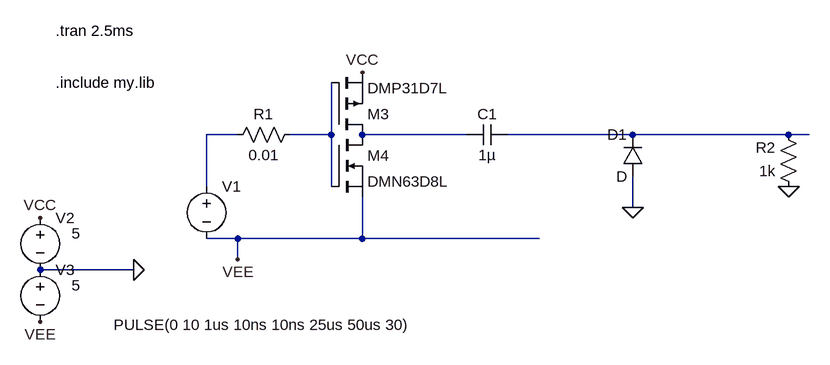
[diagram p0: schematic Draft102.asc]
Draft102.asc, the LTspice schematic file:
Version 4
SHEET 1 5720 1740
WIRE -48 -64 -96 -64
WIRE 96 -64 96 -144
WIRE 96 -64 32 -64
WIRE 304 -64 144 -64
WIRE 560 -64 368 -64
WIRE 800 -64 560 -64
WIRE 832 -64 800 -64
WIRE -96 16 -96 -64
WIRE 96 16 96 -64
WIRE 560 48 560 0
WIRE -48 96 -96 96
WIRE 144 96 144 32
WIRE 144 96 -48 96
WIRE 416 96 144 96
WIRE -48 128 -48 96
WIRE -208 144 -352 144
FLAG -208 144 0
FLAG -352 64 VCC
FLAG 800 16 0
FLAG 144 -160 VCC
FLAG 560 48 0
FLAG -352 224 VEE
FLAG -48 128 VEE
SYMBOL voltage -352 48 R0
WINDOW 123 0 0 Left 0
WINDOW 39 0 0 Left 0
WINDOW 3 48 40 Left 2
SYMATTR Value 5
SYMATTR InstName V2
SYMBOL voltage -96 0 R0
WINDOW 123 0 0 Left 0
WINDOW 39 0 0 Left 0
WINDOW 3 -143 229 Left 2
SYMATTR Value PULSE(0 10 1us 10ns 10ns 25us 50us 30)
SYMATTR InstName V1
SYMBOL res 48 -80 R90
WINDOW 0 0 56 VBottom 2
WINDOW 3 32 56 VTop 2
SYMATTR InstName R1
SYMATTR Value 0.01
SYMBOL res 816 32 R180
WINDOW 0 36 76 Left 2
WINDOW 3 36 40 Left 2
SYMATTR InstName R2
SYMATTR Value 1k
SYMBOL cap 368 -80 R90
WINDOW 0 0 32 VBottom 2
WINDOW 3 32 32 VTop 2
SYMATTR InstName C1
SYMATTR Value 1µ
SYMBOL pmos 96 -64 M180
SYMATTR InstName M3
SYMATTR Value DMP31D7L
SYMATTR Prefix X
SYMBOL nmos 96 -64 R0
SYMATTR InstName M4
SYMATTR Value DMN63D8L
SYMATTR Prefix X
SYMBOL diode 576 0 R180
WINDOW 0 24 64 Left 2
WINDOW 3 24 0 Left 2
SYMATTR InstName D1
SYMBOL voltage -352 128 R0
WINDOW 123 0 0 Left 0
WINDOW 39 0 0 Left 0
WINDOW 3 48 40 Left 2
SYMATTR Value 5
SYMATTR InstName V3
TEXT -328 -224 Left 2 !.tran 2.5ms
TEXT -328 -144 Left 2 !.include my.lib

The netlist it stands for:
* Draft102.asc
V2 VCC 0 5
V1 N001 VEE PULSE(0 10 1us 10ns 10ns 25us 50us 30)
R1 N002 N001 0.01
R2 0 N004 1k
C1 N004 N003 1µ
XM3 N003 N002 VCC DMP31D7L  ; pins D G S
XM4 N003 N002 VEE DMN63D8L  ; pins D G S
D1 0 N004 D
V3 0 VEE 5
.model D D
.lib standard.dio
.tran 2.5ms
.include my.lib
.backanno
.end